# EasyEDA Pro project ProDoc_Board1_1_2025-02-10.epro

# Schematic Schematic1_1
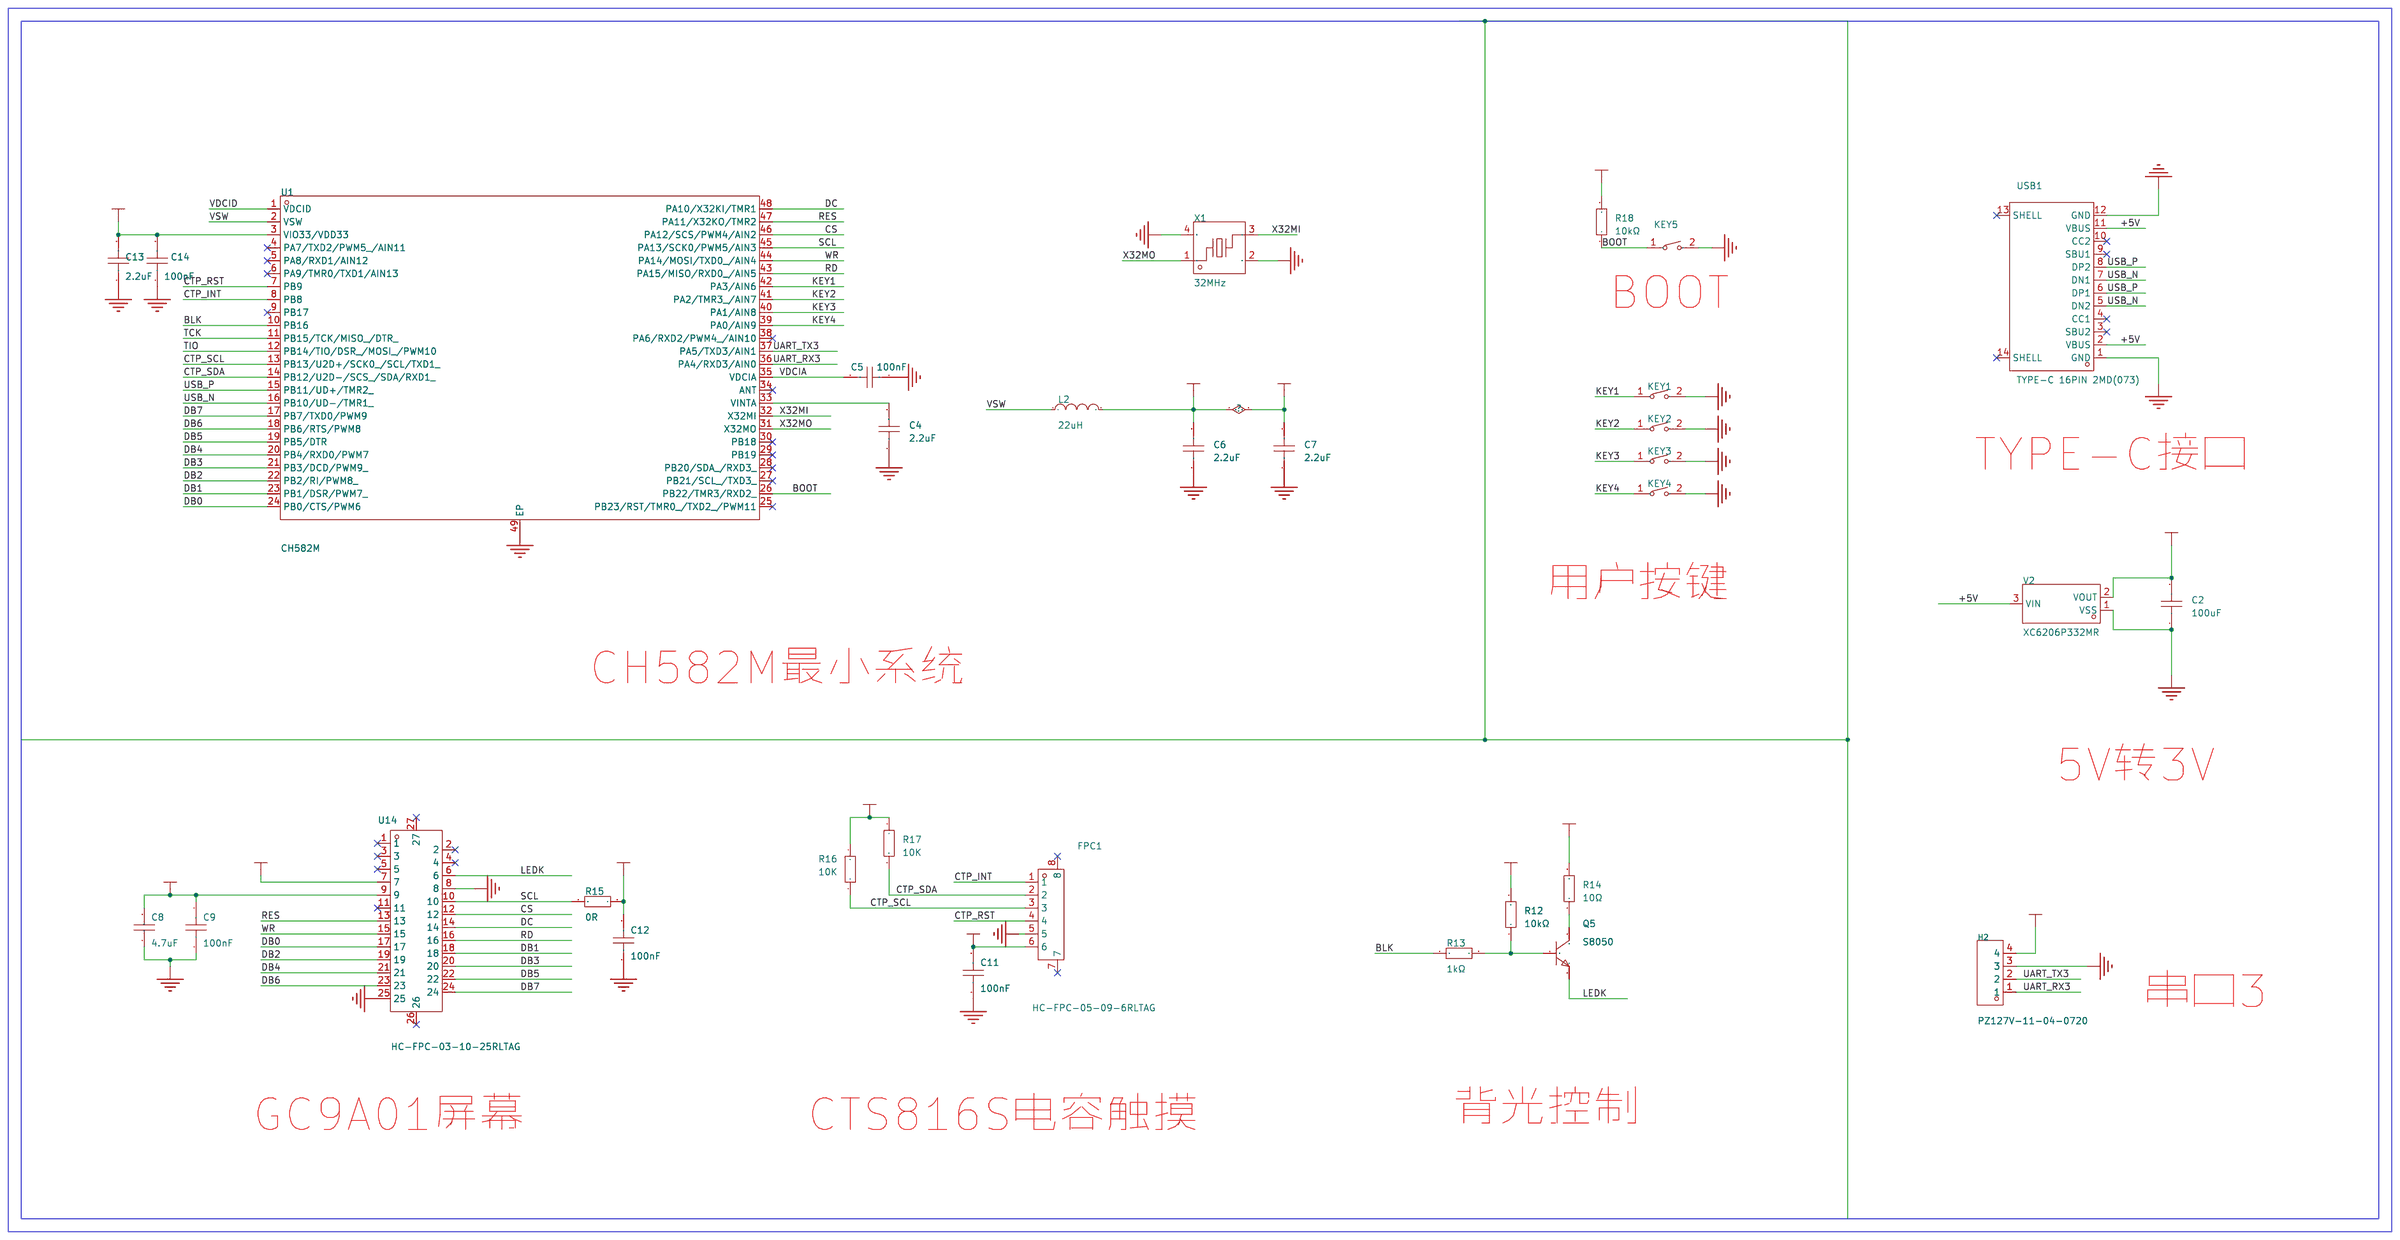
[diagram p0: schematic sheet]

## Parts
C2  100uF  [C1206]
C4  2.2uF  [C0603]
C5  100nF  [C0603]
C6  2.2uF  [C0603]
C7  2.2uF  [C0603]
C8  4.7uF  [C0603]
C9  100nF  [C0603]
C11  100nF  [C0603]
C12  100nF  [C0603]
C13  2.2uF  [C0603]
C14  100nF  [C0603]
FPC1  HC-FPC-05-09-6RLTAG  [FPC-SMD_6P-P0.50_HC-FPC-05-09-6RLTAG]
H2  PZ127V-11-04-0720  [HDR-TH_4P-P1.27-V-M]
KEY1  YTS1C0051AWG00  [SW-SMD_L6.1-W3.6-LS8.0]
KEY2  YTS1C0051AWG00  [SW-SMD_L6.1-W3.6-LS8.0]
KEY3  YTS1C0051AWG00  [SW-SMD_L6.1-W3.6-LS8.0]
KEY4  YTS1C0051AWG00  [SW-SMD_L6.1-W3.6-LS8.0]
KEY5  YTS1C0051AWG00  [SW-SMD_L6.1-W3.6-LS8.0]
L2  22uH  [L0603]
Q5  S8050  [SOT-23-3_L2.9-W1.3-P1.90-LS2.4-BR]
R12  10kΩ  [R0603]
R13  1kΩ  [R0603]
R14  10Ω  [R0603]
R15  0R  [R0603]
R16  10K  [R0603]
R17  10K  [R0603]
R18  10kΩ  [R0603]
U1  CH582M  [QFN-48_L5.0-W5.0-P0.35-BL-EP]
U14  HC-FPC-03-10-25RLTAG  [FPC-SMD_HCTL_HC-FPC-03-10-25RLTAG]
USB1  TYPE-C 16PIN 2MD(073)  [USB-C-SMD_TYPE-C-6PIN-2MD-073]
V2  XC6206P332MR  [SOT-23-3_L3.0-W1.7-P0.95-LS2.9-BR]
X1  32MHz  [CRYSTAL-SMD_4P-L2.0-W1.6-BL]

## Library data of the parts
C2 C4-C7 C13 = CAP_0603: Supplier Footprint: 0603
C8 = CL10A475KO8NNNC: 容值:4.7uF;精度:±10%;额定电压:16V;材质(温度系数):X5R;; LCSC Part Name: 4.7uF ±10% 16V; Supplier Part: C19666; Manufacturer: SAMSUNG(三星); Supplier Footprint: 0603; JLCPCB Part Class: 基础库; Datasheet: https://atta.szlcsc.com/upload/public/pdf/source/20160218/1457707763339.pdf; Supplier: LCSC; Tolerance: ±10%; Voltage Rated: 16V; Temperature Coefficient: X5R
C9 C11 C12 C14 = CC0603KRX7R9BB104: 容值:100nF;精度:±10%;额定电压:50V;材质(温度系数):X7R;; LCSC Part Name: 100nF ±10% 50V; Supplier Part: C14663; Manufacturer: YAGEO(国巨); Supplier Footprint: 0603; JLCPCB Part Class: 基础库; Datasheet: https://atta.szlcsc.com/upload/public/pdf/source/20180910/C282072_33301C7F631E79921B82A8DAC6BCC5B3.pdf; Supplier: LCSC; Tolerance: ±10%; Voltage Rated: 50V; Temperature Coefficient: X7R
FPC1 = HC-FPC-05-09-6RLTAG: 锁定特性:翻盖式;触点类型:双侧触点/上下接;触点数量:6P;间距:0.5mm;安装类型:卧贴;工作温度范围:-55℃~+85℃;; LCSC Part Name: 翻盖式 双侧触点/上下接 P数:6P 间距:0.5mm; Supplier Part: C5213748; Manufacturer: HCTL(华灿天禄); Supplier Footprint: SMD,P=0.5mm,卧贴; JLCPCB Part Class: 扩展库; Datasheet: https://atta.szlcsc.com/upload/public/pdf/source/20221026/52A26161A88FCE07A06989F8D4399614.pdf; Supplier: LCSC; Locking Feature: 翻盖式; Contact Type: 双侧触点/上下接; Number of Contacts: 6P; Pitch: 0.5mm; Mounting Type: 卧贴; FFC, FCB Thickness: 0.3mm; Height Above Board: 1mm; Contact Material: 铜合金; Operating Temperature Range: -55℃~+85℃
H2 = PZ127V-11-04-0720: 插针结构:1x4P;间距:1.27mm;行距:-;圆针/方针:-;安装类型:直插;排数:单排;总PIN位数:4P;额定电流:-;额定电压:-;配合针长度:3.9mm;塑高:1mm;端接针长度:2.3mm;触头材质:黄铜;触头镀层:-;工作温度范围:-40℃~+105℃;焊接温度(最大值):-;颜色:黑色;; LCSC Part Name: 间距:1.27mm 1x4P 直插; Supplier Part: C541879; Manufacturer: XFCN(兴飞); Supplier Footprint: 插件,P=1.27mm; JLCPCB Part Class: 扩展库; Datasheet: https://atta.szlcsc.com/upload/public/pdf/source/20200519/C541879_5CD99C402ABEE613587AE88FBA356357.pdf; Supplier: LCSC; Pin Structure: 1x4P; Pitch: 1.27mm; Mounting Type: 直插; Number of Rows: 单排; Number of Pins: 4P; Length of Mating Pin: 3.9mm; Insulation Height: 1mm; Length of End Connection Pin: 2.3mm; Contact Material: 黄铜; Operating Temperature Range: -40℃~+105℃; Color: 黑色
KEY1-KEY5 = YTS1C0051AWG00: 开关长度:6.1mm;开关宽度:3.6mm;开关高度:2.5mm;机械寿命:-;; LCSC Part Name: 白色按键头3.6x6.1x2.5 180gf两脚贴片; Supplier Part: C5159017; Manufacturer: YIYUAN(怡远); Supplier Footprint: SMD; JLCPCB Part Class: 扩展库; Datasheet: https://atta.szlcsc.com/upload/public/pdf/source/20220909/90D1F3506E0247DF6BB595157A95988A.pdf; Supplier: LCSC; Switch Length: 6.1mm; Switch Width: 3.6mm; Switch Height: 2.5mm
L2 = L_0603
Q5 = S8050: NPN 25V 500mA 120-400 SOT-23; Supplier Part: C2931719; Manufacturer: Doeshare(德芯); Supplier Footprint: SOT-23; JLCPCB Part Class: 扩展库; Datasheet: https://atta.szlcsc.com/upload/public/pdf/source/20220117/E6D3315E0D6ADDB25840BFFAC039C5C0.pdf; Supplier: LCSC
R12 R18 = 0603WAF1002T5E: 电阻类型:厚膜电阻;阻值:10kΩ;精度:±1%;功率:100mW;最大工作电压:75V;温度系数:±100ppm/℃;; LCSC Part Name: 厚膜电阻 10kΩ ±1% 100mW; Supplier Part: C25804; Manufacturer: UNI-ROYAL(厚声); Supplier Footprint: 0603; JLCPCB Part Class: 基础库; Datasheet: https://atta.szlcsc.com/upload/public/pdf/source/20200306/C422600_1E6D84923E4A46A82E41ADD87F860B5C.pdf; Supplier: LCSC; Type: 厚膜电阻; Tolerance: ±1%; Power(Watts): 100mW; Overload Voltage (Max): 75V; Temperature Coefficient: ±100ppm/℃; Operating Temperature Range: -55℃~+155℃
R13 = 0603WAF1001T5E: 电阻类型:厚膜电阻;阻值:1kΩ;精度:±1%;功率:100mW;最大工作电压:75V;温度系数:±100ppm/℃;; LCSC Part Name: 1kΩ ±1% 100mW 厚膜电阻; Supplier Part: C21190; Manufacturer: UNI-ROYAL(厚声); Supplier Footprint: 0603; JLCPCB Part Class: 基础库; Datasheet: https://atta.szlcsc.com/upload/public/pdf/source/20200306/C422600_1E6D84923E4A46A82E41ADD87F860B5C.pdf; Supplier: LCSC; Type: 厚膜电阻; Tolerance: ±1%; Power(Watts): 100mW; Overload Voltage (Max): 75V; Temperature Coefficient: ±100ppm/℃; Operating Temperature Range: -55℃~+155℃
R14 = 0603WAF100JT5E: 电阻类型:厚膜电阻;阻值:10Ω;精度:±1%;功率:100mW;最大工作电压:75V;温度系数:±400ppm/℃;; LCSC Part Name: 10Ω ±1% 100mW 厚膜电阻; Supplier Part: C22859; Manufacturer: UNI-ROYAL(厚声); Supplier Footprint: 0603; JLCPCB Part Class: 基础库; Datasheet: https://atta.szlcsc.com/upload/public/pdf/source/20200306/C422600_1E6D84923E4A46A82E41ADD87F860B5C.pdf; Supplier: LCSC; Type: 厚膜电阻; Tolerance: ±1%; Power(Watts): 100mW; Overload Voltage (Max): 75V; Temperature Coefficient: ±400ppm/℃; Operating Temperature Range: -55℃~+155℃
R15-R17 = Res_0603: Supplier Footprint: 0603
U1 = CH582M: CPU内核:RISC-V;程序存储容量:512KB;RAM总容量:32KB;GPIO端口数量:40;工作电压范围:2.3V~3.6V;CPU最大主频:80MHz;程序存储器类型:FLASH;; Supplier Part: C2920766; Manufacturer: WCH(南京沁恒); Supplier Footprint: QFN-48-EP(5x5); JLCPCB Part Class: 扩展库; Datasheet: https://atta.szlcsc.com/upload/public/pdf/source/20220111/7785F6388C97C318998CCEA67CDD9164.pdf; Supplier: LCSC; CPU Core: RISC-V; Program Storage Size: 512KB; RAM Size: 32KB; GPIO Ports Number: 40; Operating Voltage Range: 2.3V~3.6V; CPU Maximum Speed: 80MHz; Program Memory Type: FLASH; Operating Temperature Range: -40℃~+85℃; ADC (Bit): 12bit; PWM (Bit): 26bit; 32Bit Timer: 4; UART/USART: 4; I2C: 1; SPI: 2
U14 = HC-FPC-03-10-25RLTAG_C3012332: 锁定特性:翻盖式;触点类型:下接;触点数量:25P;间距:0.3mm;安装类型:卧贴;工作温度范围:-55℃~+85℃;; LCSC Part Name: 翻盖式 下接 P数:25P 间距:0.3mm; Supplier Part: C3012332; Manufacturer: HCTL(华灿天禄); Supplier Footprint: SMD,P=0.3mm,卧贴; JLCPCB Part Class: 扩展库; Datasheet: https://atta.szlcsc.com/upload/public/pdf/source/20240313/E73B8B009859F95ACD7D175A0E675B64.pdf; Supplier: LCSC; Locking Feature: 翻盖式; Contact Type: 下接; Number of Contacts: 25P; Pitch: 0.3mm; Mounting Type: 卧贴; FFC, FCB Thickness: 0.2mm; Height Above Board: 1mm; Contact Material: 铜合金; Contact Plating: 金; Operating Temperature Range: -55℃~+85℃
USB1 = TYPE-C 16PIN 2MD(073): 连接器类型:Type-C;标准:USB 3.1;公母:母;安装方式:卧贴;触点数量:16P;端口数量:1;额定电流 - 电源:5A;工作温度范围:-25℃~+85℃;; LCSC Part Name: Type-C 母 卧贴; Supplier Part: C2765186; Manufacturer: SHOU HAN(首韩); Supplier Footprint: SMD; Datasheet: https://atta.szlcsc.com/upload/public/pdf/source/20211123/39B17C16241EAC15C5E277BDA434118E.pdf; Supplier: LCSC; Connector Type: Type-C; Standard: USB 3.1; Gender: 母; Mounting Style: 卧贴; Number of Contacts: 16P; Number of Ports: 1; Current Rating - Power (Max): 5A; Operating Temperature Range: -25℃~+85℃; Rated Voltage (Max): 5V; Connect-Disconnect Life: 5千次; Core Colour: 黑色
V2 = XC6206P332MR_C347376: +3V3; LCSC Part Name: +3V3; Supplier Part: C347376; Manufacturer: UMW(友台半导体); Supplier Footprint: SOT-23; JLCPCB Part Class: 扩展库; Datasheet: https://atta.szlcsc.com/upload/public/pdf/source/20231109/6B10DA60E52FC900BF97E3EFEB5D6341.pdf; Supplier: LCSC; Output Type: 固定; Maximum Input Voltage: 8V; Output Voltage: +3V3; MAX Output Current: 250mA; Power Supply Rejection Ratio (PSRR): 40dB@(1kHz); Dropout Voltage: 240mV@(50mA); Operating Temperature: -25℃~+80℃; Output Polarity: 正极; Number of Outputs: 1
X1 = XL7EL89CKI-111YLC-32M: 晶振类型:贴片晶振;频率:32MHz;常温频差:±10ppm;外接负载电容:8pF;频率稳定度(全温):±20ppm;; LCSC Part Name: 32MHz ±10ppm 8pF; Supplier Part: C2965582; Manufacturer: YXC(扬兴晶振); Supplier Footprint: SMD2016-4P; JLCPCB Part Class: 扩展库; Datasheet: https://atta.szlcsc.com/upload/public/pdf/source/20240329/C26C9A15A73CBCFBF373B30A8E126750.pdf; Supplier: LCSC; Crystal Type: 贴片晶振; Normal temperature Frequency Tolerance: ±10ppm; External load capacitor: 8pF; Frequency Stability(Full temperature range): ±20ppm; Operating Temperature: -40℃~+85℃

## Nets
+3V3: C2.2 C8.2 C9.2 C11.2 C12.2 C13.2 C14.2 FPC1.6 H2.4 R12.2 R14.2 R15.1 R16.1 R17.1 R18.2 U1.3(VIO33/VDD33) U14.7 U14.9 V2.2(VOUT)
+5V: USB1.2(VBUS) USB1.11(VBUS) V2.3(VIN)
GND: C2.1 C4.1 C5.1 C6.1 C7.1 C8.1 C9.1 C11.1 C12.1 C13.1 C14.1 FPC1.5 H2.3 KEY1.2 KEY2.2 KEY3.2 KEY4.2 KEY5.2 U1.49(EP) U14.8 U14.25 USB1.1(GND) USB1.12(GND) V2.1(VSS) X1.2(GND) X1.4(GND)
BLK: R13.1 U1.10(PB16)
BOOT: KEY5.1 R18.1 U1.26(PB22/TMR3/RXD2_)
CS: U1.46(PA12/SCS/PWM4/AIN2) U14.12
CTP_INT: FPC1.1 U1.8(PB8)
CTP_RST: FPC1.4 U1.7(PB9)
CTP_SCL: FPC1.3 R16.2 U1.13(PB13/U2D+/SCK0_/SCL/TXD1_)
CTP_SDA: FPC1.2 R17.2 U1.14(PB12/U2D-/SCS_/SDA/RXD1_)
DB0: U1.24(PB0/CTS/PWM6) U14.17
DB1: U1.23(PB1/DSR/PWM7_) U14.18
DB2: U1.22(PB2/RI/PWM8_) U14.19
DB3: U1.21(PB3/DCD/PWM9_) U14.20
DB4: U1.20(PB4/RXD0/PWM7) U14.21
DB5: U1.19(PB5/DTR) U14.22
DB6: U1.18(PB6/RTS/PWM8) U14.23
DB7: U1.17(PB7/TXD0/PWM9) U14.24
DC: U1.48(PA10/X32KI/TMR1) U14.14
KEY1: KEY1.1 U1.42(PA3/AIN6)
KEY2: KEY2.1 U1.41(PA2/TMR3_/AIN7)
KEY3: KEY3.1 U1.40(PA1/AIN8)
KEY4: KEY4.1 U1.39(PA0/AIN9)
LEDK: Q5.2(E) U14.6
RD: U1.43(PA15/MISO/RXD0_/AIN5) U14.16
RES: U1.47(PA11/X32KO/TMR2) U14.13
SCL: R15.2 U1.45(PA13/SCK0/PWM5/AIN3) U14.10
TCK: U1.11(PB15/TCK/MISO_/DTR_)
TIO: U1.12(PB14/TIO/DSR_/MOSI_/PWM10)
UART_RX3: H2.1 U1.36(PA4/RXD3/AIN0)
UART_TX3: H2.2 U1.37(PA5/TXD3/AIN1)
USB_N: U1.16(PB10/UD-/TMR1_) USB1.5(DN2) USB1.7(DN1)
USB_P: U1.15(PB11/UD+/TMR2_) USB1.6(DP1) USB1.8(DP2)
VDCIA: C5.2 C6.2 C7.2 L2.2 U1.1(VDCID) U1.35(VDCIA)
VSW: L2.1 U1.2(VSW)
WR: U1.44(PA14/MOSI/TXD0_/AIN4) U14.15
X32MI: U1.32(X32MI) X1.3
X32MO: U1.31(X32MO) X1.1
Net-(C4-2): C4.2 U1.33(VINTA)
Net-(Q5-1): Q5.1(B) R12.1 R13.2
Net-(Q5-3): Q5.3(C) R14.1

Not connected (* = marked no-connect by the designer): FPC1 7* 8*; U1 4(PA7/TXD2/PWM5_/AIN11)* 5(PA8/RXD1/AIN12)* 6(PA9/TMR0/TXD1/AIN13)* 9(PB17)* 25(PB23/RST/TMR0_/TXD2_/PWM11)* 27(PB21/SCL_/TXD3_)* 28(PB20/SDA_/RXD3_)* 29(PB19)* 30(PB18)* 34(ANT)* 38(PA6/RXD2/PWM4_/AIN10)*; U14 1* 2* 3* 4* 5* 11* 26* 27*; USB1 3(SBU2)* 4(CC1)* 9(SBU1)* 10(CC2)* 13(SHELL)* 14(SHELL)*

## Notes on the sheet
- BOOT
- TYPE-C接口
- 用户按键
- CH582M最小系统
- 5V转3V
- 串口3
- 背光控制
- GC9A01屏幕
- CTS816S电容触摸

# Board PCB1_1
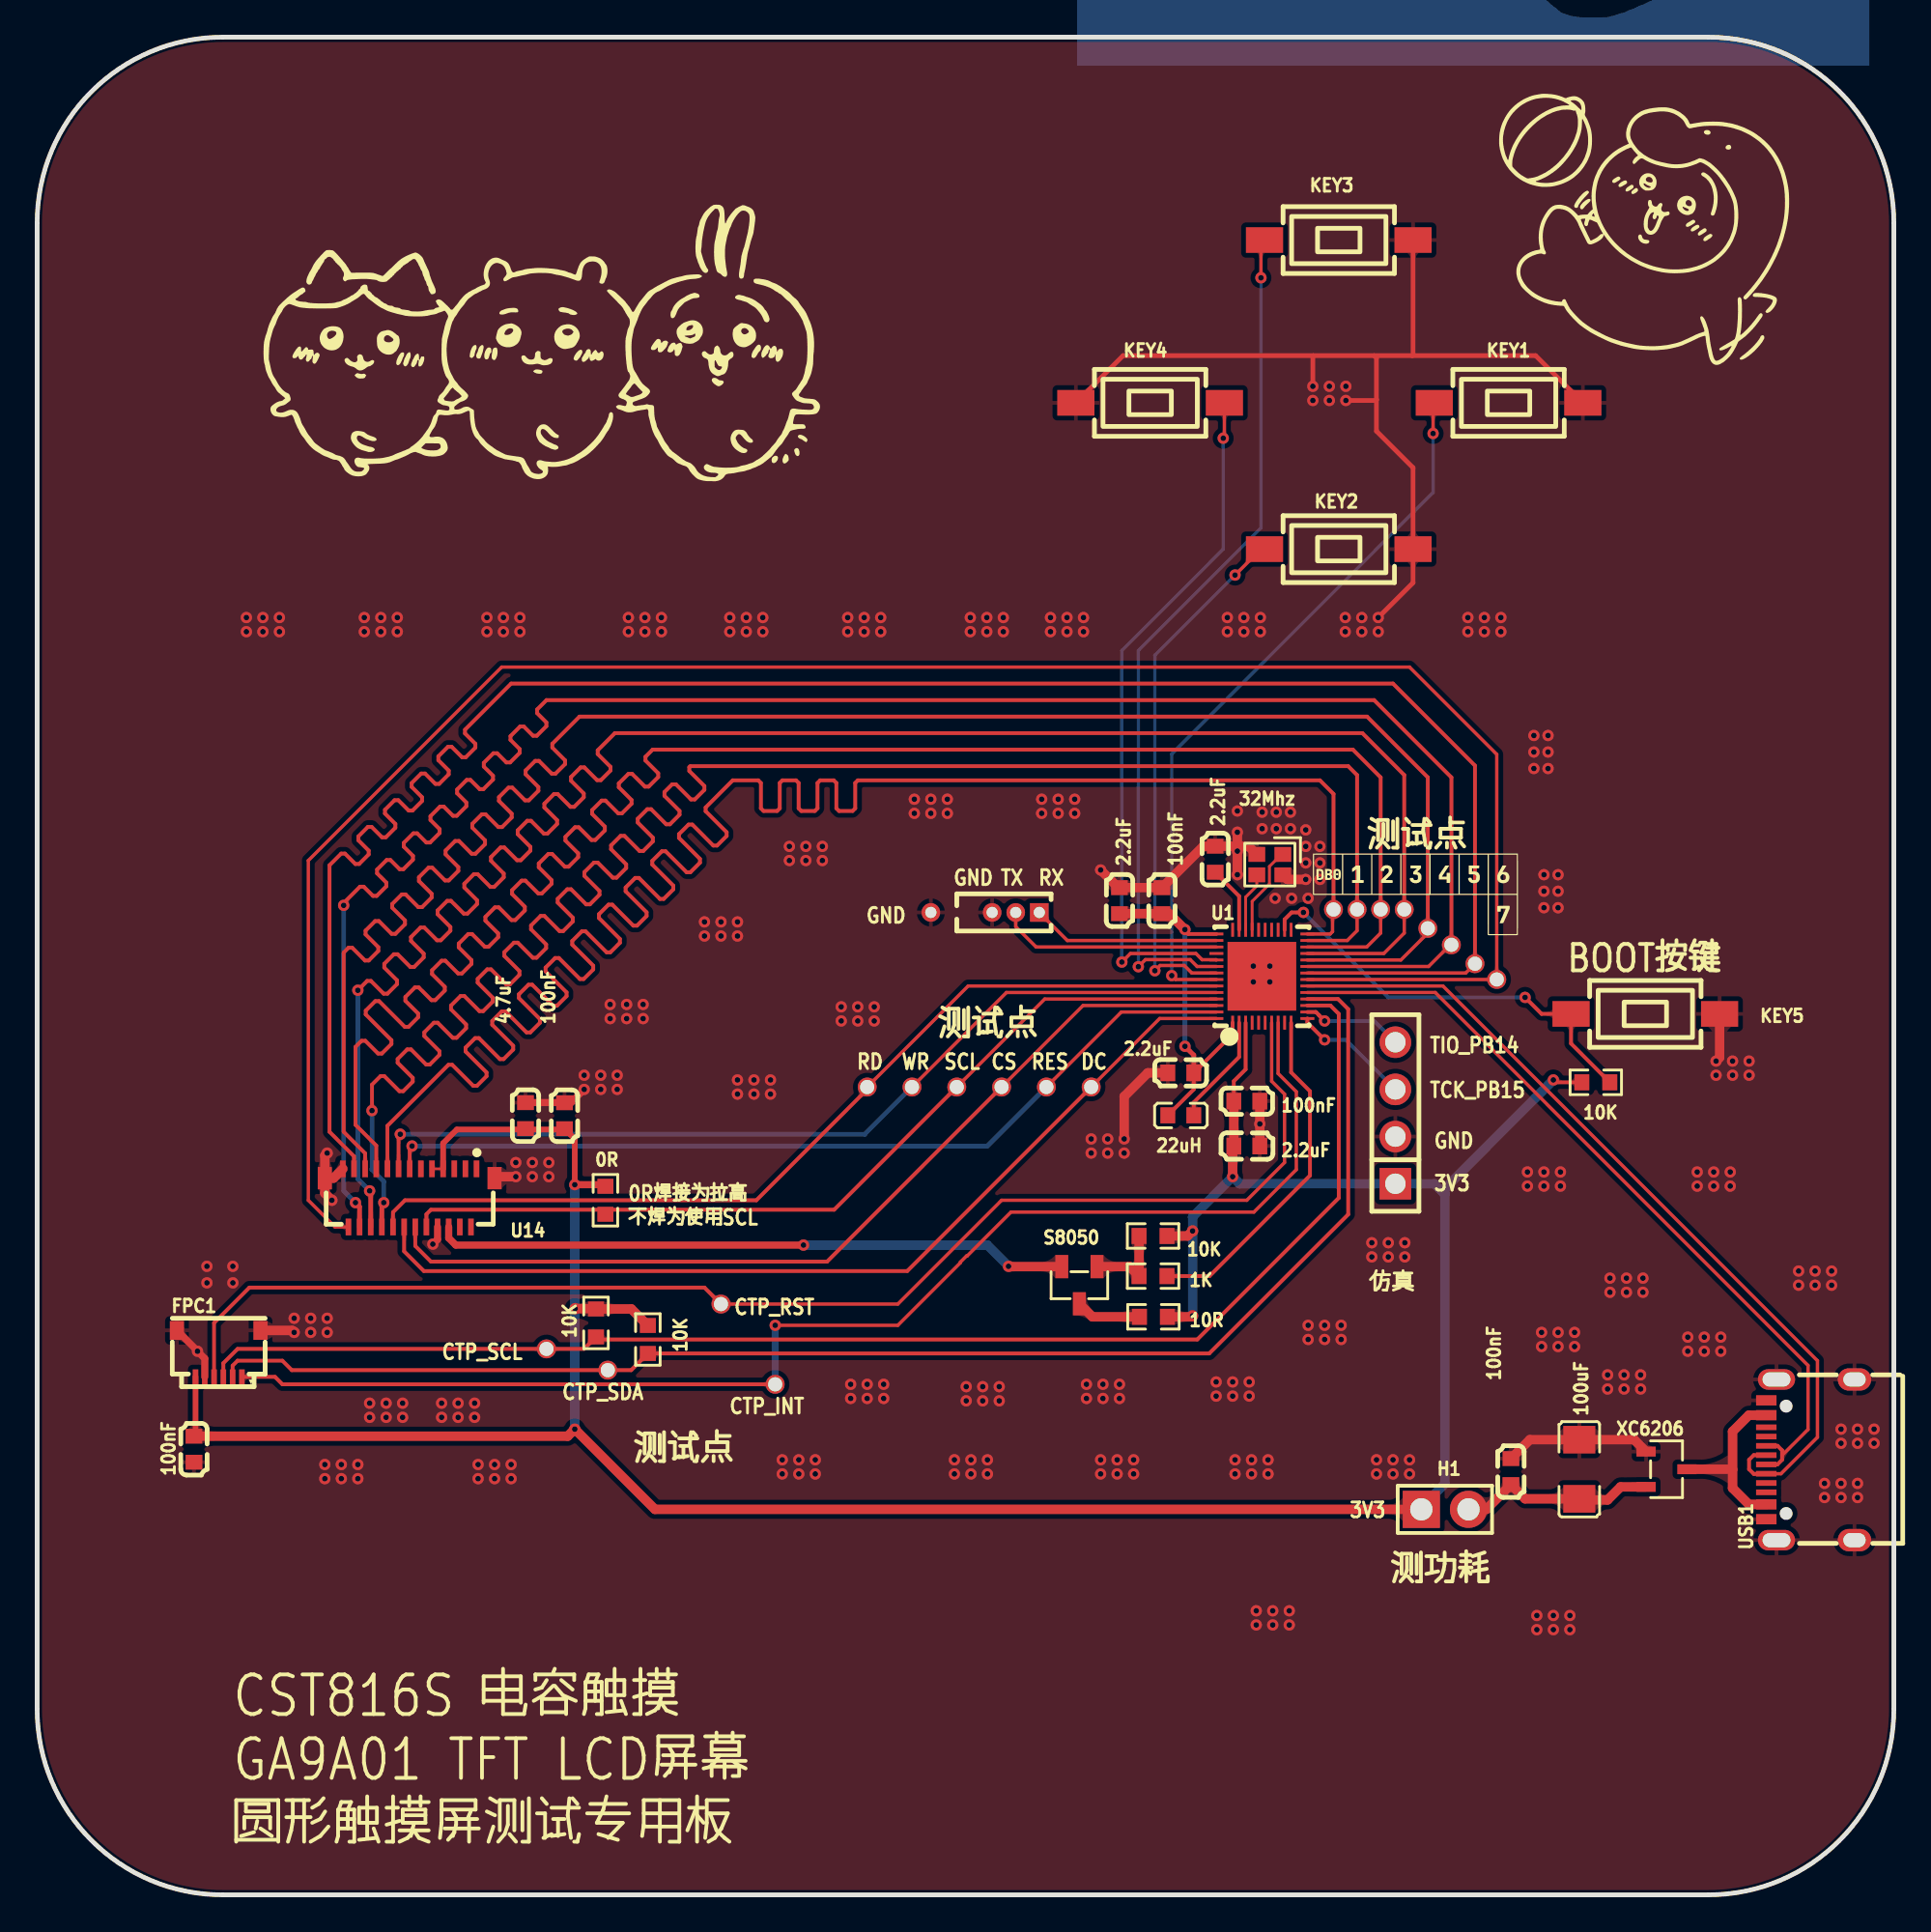
[diagram p1: board, top side]
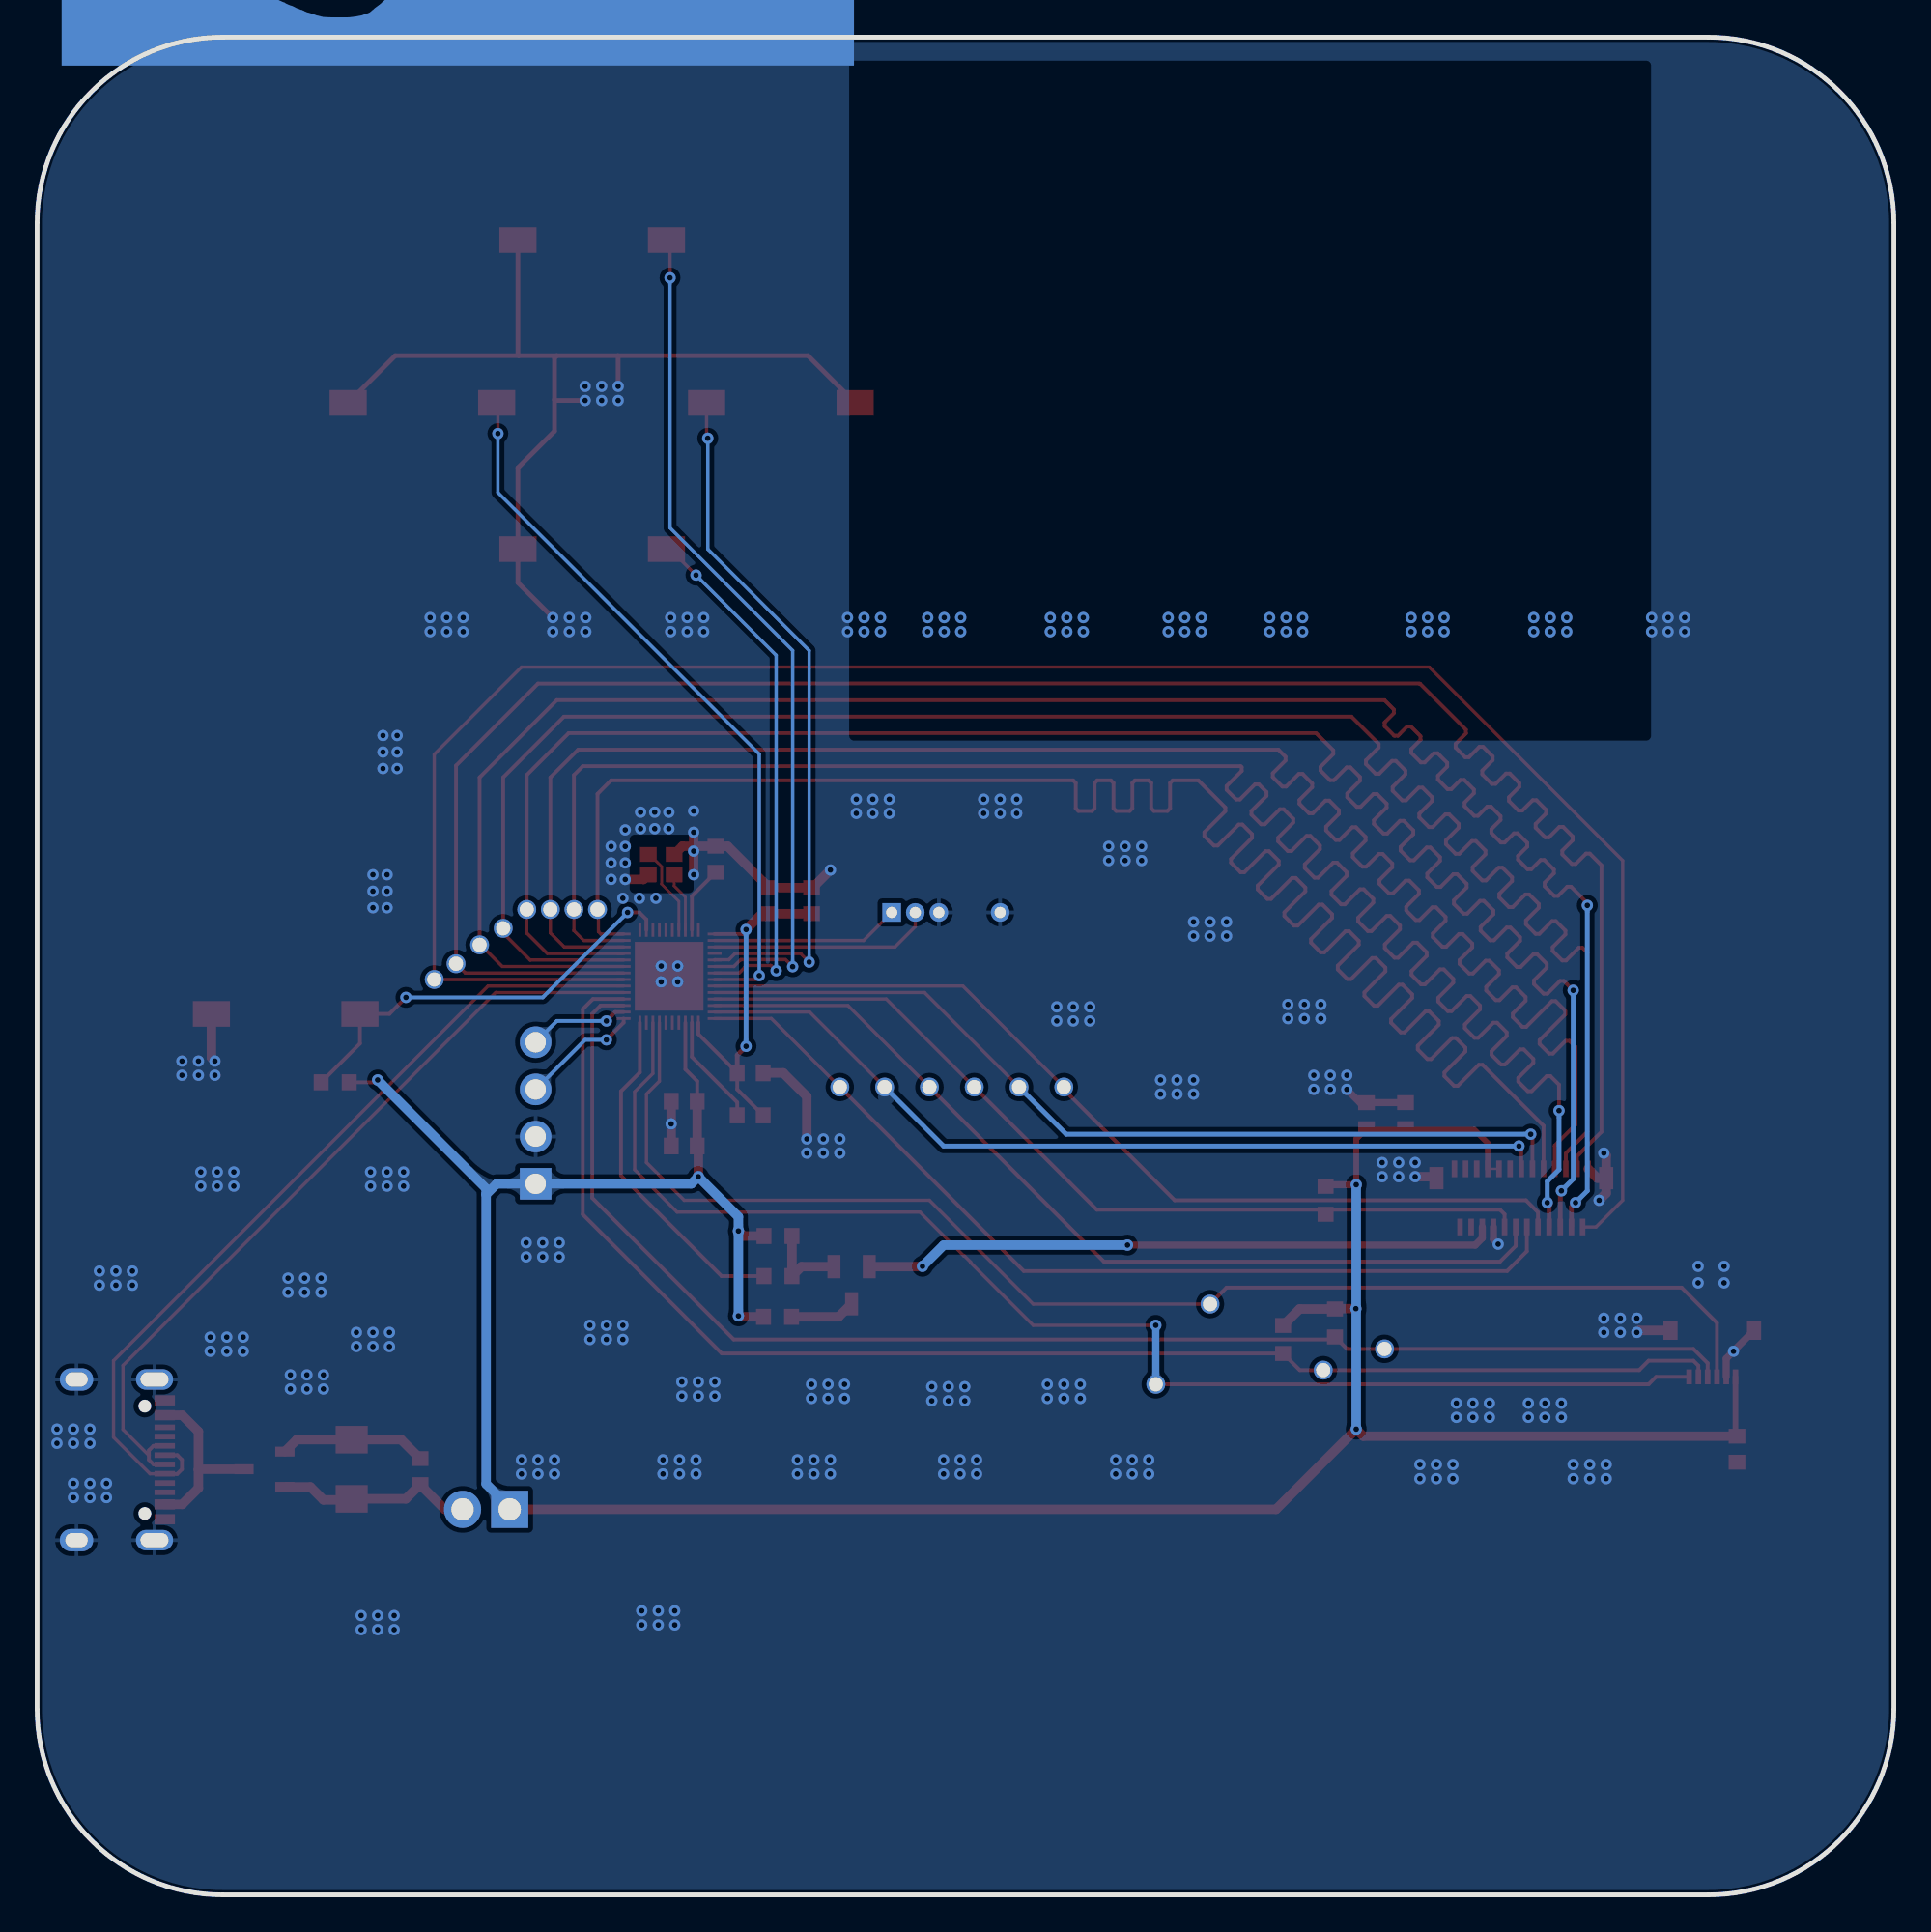
[diagram p2: board, bottom side, seen from below]

Outline 100 x 100 mm; copper layers: Top Layer, Bottom Layer. Coordinates in mm from the lower left corner of the outline.
Outline path: 0,90 0,10 arc(2.93,2.93) 10,0 90,0 arc(97.07,2.93) 100,10 100,90 arc(97.07,97.07) 90,100 10,100 arc(2.93,97.07) 0,90
Stack: Top Layer 0.035mm / Dielectric1 1.51mm FR4 er 4.5 / Bottom Layer 0.035mm

## Design rules (mm)
template: 自定义配置
spacing copperThickness1oz (default): track to track 0.102, other pairs 0.152 to 0.3
spacing copperThickness2oz: track to track 0.203, other pairs 0.152 to 0.3
track width copperThickness1oz (default): min 0.127, default 0.254, max 2.54
track width copperThickness2oz: min 0.203, default 0.254, max 2.54
differential pair differentialPair (default): width min 0.127, default 0.254, max 2.54; gap min 0.152, default 0.152
via viaSize (default): diameter min 0.5, default 0.61, max 10; hole min 0.3, default 0.305, max 6.3

## Placement (name value [footprint] x y rotation side)
0R  0R  [R0603]  30.61 37.39 270 top
1K  1kΩ  [R0603]  60.1 33.31 180 top
2.2uF  -  [C0603]  63.45 55.75 270 top
2.2uF#2  -  [C0603]  58.29 53.52 270 top
2.2uF#3  -  [C0603]  61.59 44.25 0 top
2.2uF#4  -  [C0603]  65.15 40.31 180 top
4.7uF  4.7uF  [C0603]  26.3 41.95 270 top
10K  -  [R0603]  60.1 35.47 0 top
10K#2  -  [R0603]  30.1 30.79 270 top
10K#3  -  [R0603]  32.89 29.9 270 top
10K#4  -  [R0603]  83.95 43.74 180 top
10R  10Ω  [R0603]  60.12 31.12 0 top
22uH  22uH  [L0603]  61.59 41.96 180 top
32Mhz  32MHz  [CRYSTAL-SMD_4P-L2.0-W1.6-BL]  66.39 55.46 180 top
100nF  -  [C0603]  28.4 41.94 270 top
100nF#2  -  [C0603]  8.45 23.99 90 top
100nF#3  -  [C0603]  79.37 22.78 270 top
100nF#4  -  [C0603]  65.15 42.72 180 top
100nF#5  -  [C0603]  60.58 53.52 270 top
100uF  100uF  [C1206]  83.06 22.91 270 top
FPC1  HC-FPC-05-09-6RLTAG  [FPC-SMD_6P-P0.50_HC-FPC-05-09-6RLTAG]  9.78 29.13 0 top
H1  PZ254V-11-02P  [HDR-TH_2P-P2.54-V-M]  75.82 20.75 0 top
KEY1  YTS1C0051AWG00  [SW-SMD_L6.1-W3.6-LS8.0]  79.25 80.32 0 top
KEY2  YTS1C0051AWG00  [SW-SMD_L6.1-W3.6-LS8.0]  70.1 72.44 0 top
KEY3  YTS1C0051AWG00  [SW-SMD_L6.1-W3.6-LS8.0]  70.1 89.08 0 top
KEY4  YTS1C0051AWG00  [SW-SMD_L6.1-W3.6-LS8.0]  59.94 80.32 180 top
KEY5  YTS1C0051AWG00  [SW-SMD_L6.1-W3.6-LS8.0]  86.61 47.42 0 top
NOREF  -  [Pad_e1168]  36.83 31.8 0 top
NOREF#2  -  [Pad_e122]  72.36 53.04 0 top
NOREF#3  -  [Pad_e1167]  39.75 27.48 0 top
NOREF#4  -  [Pad_e134]  76.17 51.14 0 top
NOREF#5  -  [Pad_e109]  69.82 53.04 0 top
NOREF#6  -  [Pad_e1414]  51.94 43.48 0 top
NOREF#7  -  [Pad_e135]  77.44 50.12 0 top
NOREF#8  -  [Pad_e1418]  47.12 43.48 0 top
NOREF#9  -  [Pad_e1169]  27.43 29.39 0 top
NOREF#10  -  [Pad_e129]  73.63 53.04 0 top
NOREF#11  -  [Pad_e1413]  56.77 43.48 0 top
NOREF#12  -  [Pad_e110]  71.09 53.04 0 top
NOREF#13  -  [Pad_e133]  74.9 52.03 0 top
NOREF#14  -  [Pad_e1419]  44.7 43.48 0 top
NOREF#15  -  [Pad_e1417]  49.53 43.48 0 top
NOREF#16  -  [Pad_e154]  78.61 49.28 0 top
NOREF#17  -  [Pad_e1416]  54.36 43.48 0 top
NOREF#18  -  [Pad_e1170]  30.73 28.25 0 top
RX  PZ127V-11-04-0720  [HDR-TH_4P-P1.27-V-M]  52.07 52.88 180 top
S8050  S8050  [SOT-23-3_L2.9-W1.3-P1.90-LS2.4-BR]  56.13 32.82 90 top
U1  CH582M  [QFN-48_L5.0-W5.0-P0.35-BL-EP]  65.96 49.45 0 top
U14  HC-FPC-03-10-25RLTAG  [FPC-SMD_HCTL_HC-FPC-03-10-25RLTAG]  20.07 37.52 180 top
USB1  TYPE-C 16PIN 2MD(073)  [USB-C-SMD_TYPE-C-6PIN-2MD-073]  95.5 23.42 90 top
XC6206  XC6206P332MR  [SOT-23-3_L3.0-W1.7-P0.95-LS2.9-BR]  87.76 22.91 180 top
仿真  2.54-1*4P母  [HDR-TH_4P-P2.54-V-F]  73.15 42.09 90 top

## Footprints (pads in the part's own frame, mm; a bottom-side part is the same pattern mirrored in y, then rotated)
C0603
  rect 0.8x0.9 smd: 1(-0.7,0) 2(0.7,0)
C1206
  rect 1.485x1.728 smd: 1(-1.593,0) 2(1.593,0)
CRYSTAL-SMD_4P-L2.0-W1.6-BL
  rect 0.9x0.8 smd: 1(-0.7,-0.55) 2(0.7,-0.55) 3(0.7,0.55) 4(-0.7,0.55)
FPC-SMD_6P-P0.50_HC-FPC-05-09-6RLTAG
  rect 0.3x0.8 smd: 1(1.25,-1.25) 2(0.75,-1.25) 3(0.25,-1.25) 4(-0.25,-1.25) 5(-0.75,-1.25) 6(-1.25,-1.25)
  rect 0.762x1.016 smd: 7(-2.25,1.25) 8(2.25,1.25)
FPC-SMD_HCTL_HC-FPC-03-10-25RLTAG
  rect 0.3x0.9 smd: 1(-3.6,-1.565) 2(-3.3,1.565) 3(-2.999,-1.565) 4(-2.7,1.565) 5(-2.4,-1.565) 6(-2.1,1.565) 7(-1.8,-1.565) 8(-1.5,1.565) 9(-1.2,-1.565) 10(-0.9,1.565) 11(-0.6,-1.565) 12(-0.299,1.565) 13(0.001,-1.565) 14(0.3,1.565) 15(0.6,-1.565) 16(0.9,1.565) 17(1.2,-1.565) 18(1.5,1.565) 19(1.8,-1.565) 20(2.1,1.565) 21(2.4,-1.565) 22(2.7,1.565) 23(3,-1.565) 24(3.3,1.565) 25(3.6,-1.565)
  rect 0.762x1.2 smd: 26(4.572,-1.065) 27(-4.572,-1.065)
HDR-TH_2P-P2.54-V-M
  rect 2x2 hole 1.2: 1(-1.27,0)
  round 2 hole 1.2: 2(1.27,0)
HDR-TH_4P-P1.27-V-M
  rect 1x1 hole 0.6: 1(-1.905,0)
  round 1 hole 0.6: 2(-0.635,0) 3(0.635,0) 4(3.937,0)
HDR-TH_4P-P2.54-V-F
  rect 1.7x1.7 hole 1.1: 1(-3.81,0)
  round 1.7 hole 1.1: 2(-1.27,0) 3(1.27,0) 4(3.81,0)
L0603
  rect 0.8x0.864 smd: 1(-0.7,0) 2(0.7,0)
Pad_e109
  round 1.016 hole 0.762: 1(0,0)
Pad_e110
  round 1.016 hole 0.762: 1(0,0)
Pad_e122
  round 1.016 hole 0.762: 1(0,0)
Pad_e129
  round 1.016 hole 0.762: 1(0,0)
Pad_e133
  round 1.016 hole 0.762: 1(0,0)
Pad_e134
  round 1.016 hole 0.762: 1(0,0)
Pad_e135
  round 1.016 hole 0.762: 1(0,0)
Pad_e154
  round 1.016 hole 0.762: 1(0,0)
Pad_e1167
  round 1.016 hole 0.762: 1(0,0)
Pad_e1168
  round 1.016 hole 0.762: 1(0,0)
Pad_e1169
  round 1.016 hole 0.762: 1(0,0)
Pad_e1170
  round 1.016 hole 0.762: 1(0,0)
Pad_e1413
  round 1.016 hole 0.762: 1(0,0)
Pad_e1414
  round 1.016 hole 0.762: 1(0,0)
Pad_e1416
  round 1.016 hole 0.762: 1(0,0)
Pad_e1417
  round 1.016 hole 0.762: 1(0,0)
Pad_e1418
  round 1.016 hole 0.762: 1(0,0)
Pad_e1419
  round 1.016 hole 0.762: 1(0,0)
QFN-48_L5.0-W5.0-P0.35-BL-EP
  rect 0.15x0.75 smd: 1(-1.575,-2.5) 2(-1.225,-2.5) 3(-0.875,-2.5) 4(-0.525,-2.5) 5(-0.175,-2.5) 6(0.175,-2.5) 7(0.525,-2.5) 8(0.875,-2.5) 9(1.225,-2.5) 10(1.575,-2.5) 25(1.575,2.5) 26(1.225,2.5) 27(0.875,2.5) 28(0.525,2.5) 29(0.175,2.5) 30(-0.175,2.5) 31(-0.525,2.5) 32(-0.875,2.5) 33(-1.225,2.5) 34(-1.575,2.5)
  rect 0.75x0.15 smd: 11(2.45,-2.275) 12(2.45,-1.925) 13(2.45,-1.575) 14(2.45,-1.225) 15(2.45,-0.875) 16(2.45,-0.525) 17(2.45,-0.175) 18(2.45,0.174) 19(2.45,0.525) 20(2.45,0.875) 21(2.45,1.225) 22(2.45,1.575) 23(2.45,1.925) 24(2.45,2.275) 35(-2.45,2.275) 36(-2.45,1.925) 37(-2.45,1.575) 38(-2.45,1.225) 39(-2.45,0.875) 40(-2.45,0.525) 41(-2.45,0.175) 42(-2.45,-0.175) 43(-2.45,-0.525) 44(-2.45,-0.875) 45(-2.45,-1.225) 46(-2.45,-1.575) 47(-2.45,-1.925) 48(-2.45,-2.275)
  rect 3.7x3.7 smd: 49(0,0)
R0603
  rect 0.806x0.864 smd: 1(-0.753,0) 2(0.753,0)
SOT-23-3_L2.9-W1.3-P1.90-LS2.4-BR
  rect 1.25x0.7 smd: 1(1,-0.95) 2(1,0.95) 3(-1,0)
SOT-23-3_L3.0-W1.7-P0.95-LS2.9-BR
  rect 1.038x0.532 smd: 1(1.101,-0.95) 2(1.101,0.95) 3(-1.101,0)
SW-SMD_L6.1-W3.6-LS8.0
  rect 2x1.38 smd: 1(-4,0) 2(4,0)
USB-C-SMD_TYPE-C-6PIN-2MD-073
  rect 0.55x1.1 smd: 1(-3.2,2.375) 2(-2.4,2.375) 11(2.4,2.375) 12(3.2,2.375)
  rect 0.3x1.1 smd: 3(-1.75,2.375) 4(-1.25,2.375) 5(-0.75,2.375) 6(-0.25,2.375) 7(0.25,2.375) 8(0.75,2.375) 9(1.25,2.375) 10(1.75,2.375)
  oval 1.1x2 hole 0.762x1.5: 13(-4.325,1.825) 14(4.325,1.825)
  oval 1.2x1.8 hole 0.762x1.2: 13(-4.325,-2.375) 14(4.325,-2.375)

## Nets
+3V3: 0R.1 2.2uF#4.2 4.7uF.2 10K.2 10K#2.1 10K#3.1 10K#4.2 10R.2 100nF.2 100nF#2.2 100nF#3.2 100nF#4.2 100uF.2 FPC1.6 H1.1 H1.2 U1.3 U14.7 U14.9 XC6206.2 仿真.1
+5V: USB1.2 USB1.11 XC6206.3
GND: 2.2uF.1 2.2uF#2.1 2.2uF#3.1 2.2uF#4.1 4.7uF.1 32Mhz.2 32Mhz.4 100nF.1 100nF#2.1 100nF#3.1 100nF#4.1 100nF#5.1 100uF.1 FPC1.5 FPC1.7 FPC1.8 KEY1.2 KEY2.2 KEY3.2 KEY4.2 KEY5.2 RX.3 RX.4 U1.49 U14.8 U14.25 U14.26 U14.27 USB1.1 USB1.12 USB1.13 USB1.14 XC6206.1 仿真.2
BLK: 1K.1 U1.10
BOOT: 10K#4.1 KEY5.1 U1.26
CS: NOREF#6.1 U1.46 U14.12
CTP_INT: FPC1.1 NOREF#3.1 U1.8
CTP_RST: FPC1.4 NOREF.1 U1.7
CTP_SCL: 10K#2.2 FPC1.3 NOREF#9.1 U1.13
CTP_SDA: 10K#3.2 FPC1.2 NOREF#18.1 U1.14
DB0: NOREF#5.1 U1.24 U14.17
DB1: NOREF#12.1 U1.23 U14.18
DB2: NOREF#2.1 U1.22 U14.19
DB3: NOREF#10.1 U1.21 U14.20
DB4: NOREF#13.1 U1.20 U14.21
DB5: NOREF#4.1 U1.19 U14.22
DB6: NOREF#7.1 U1.18 U14.23
DB7: NOREF#16.1 U1.17 U14.24
DC: NOREF#11.1 U1.48 U14.14
KEY1: KEY1.1 U1.42
KEY2: KEY2.1 U1.41
KEY3: KEY3.1 U1.40
KEY4: KEY4.1 U1.39
LEDK: S8050.2 U14.6
RD: NOREF#14.1 U1.43 U14.16
RES: NOREF#17.1 U1.47 U14.13
SCL: 0R.2 NOREF#15.1 U1.45 U14.10
TCK: U1.11 仿真.3
TIO: U1.12 仿真.4
UART_RX3: RX.1 U1.36
UART_TX3: RX.2 U1.37
USB_N: U1.16 USB1.5 USB1.7
USB_P: U1.15 USB1.6 USB1.8
VDCIA: 2.2uF#2.2 2.2uF#3.2 22uH.2 100nF#5.2 U1.1 U1.35
VSW: 22uH.1 U1.2
WR: NOREF#8.1 U1.44 U14.15
X32MI: 32Mhz.3 U1.32
X32MO: 32Mhz.1 U1.31
$1N1243: 2.2uF.2 U1.33
$1N4528: 1K.2 10K.1 S8050.1
$1N4553: 10R.1 S8050.3

Pads without a net: U1 4 5 6 9 25 27 28 29 30 34 38; U14 1 2 3 4 5 11; USB1 3 4 9 10

## Via types
v1: diameter 0.61, hole 0.305, Top Layer to Bottom Layer, 378 vias

## Routing (per net, layer and track width the routed paths; a pad name or vN(x,y) marks a point on that pad's centre or on a via; arc(x,y) is an arc through that point)
+3V3: length 172.2
  Top Layer w0.127: U14.9 U14.7
  Top Layer w0.203: 100nF#4.2 64.45,43.8 65.09,44.44 U1.3 ; 10K#4.2 81.79,43.74 v1(81.66,43.87)
  Top Layer w0.305: v1(28.96,38.23) 28.96,40.69 100nF.2 28.36,41.2 22.61,41.2 21.87,40.46 U14.7 ; FPC1.6 8.53,24.73
  Top Layer w0.381: v1(28.96,38.23) 30.52,38.23 0R.1
  Top Layer w0.508: v1(64.39,38.66) 64.39,40.25 2.2uF#4.2 100nF#4.2 ; 10K.2 61.96,35.47 v1(62.23,35.74) ; v1(62.23,31.17) 62.18,31.12 10R.2 ; 10K#3.1 32,31.54 10K#2.1 30.08,31.55 v1(28.97,31.55) ; XC6206.2 85.28,21.96 84.58,21.26 83.12,21.26 100uF.2 80.14,21.32 100nF#3.2 78.04,20.75 77.16,20.75 ; 8.53,24.73 8.57,24.69 28.58,24.69 v1(28.96,25.07) 33.27,20.75 74.38,20.75
  Bottom Layer w0.508: 75.82,37.71 75.82,22.12 74.45,20.75 ; 75.82,37.71 75.25,38.28 仿真.1 64.77,38.28 v1(64.39,38.66) 62.23,36.5 v1(62.23,35.74) v1(62.23,31.17) ; 75.82,37.71 75.82,38.02 v1(81.66,43.87) ; v1(28.96,25.07) v1(28.96,38.23)
+5V: length 9.9
  Top Layer w0.508: USB1.2 92.19,21.02 91.31,21.9 91.31,22.89 ; 91.31,22.89 91.31,24.94 92.19,25.82 USB1.11 ; 91.31,22.89 91.3,22.91 XC6206.3
GND: length 101
  Top Layer w0.254: 72.01,82.86 72.14,82.73 72.14,80.49 ; 72.01,82.86 74.06,82.86 ; 72.01,82.86 68.72,82.86 ; v1(72.23,68.76) 74.1,70.63 KEY2.2 74.1,76.82 72.14,78.79 72.14,80.49 ; 74.06,82.86 80.71,82.86 KEY1.2 ; 74.06,82.86 74.1,82.9 KEY3.2 ; 72.14,80.49 72.09,80.44 v1(70.48,80.44) ; 68.72,82.86 68.71,82.84 v1(68.71,81.2) ; 68.72,82.86 58.48,82.86 KEY4.2
  Top Layer w0.381: FPC1.5 9.03,28.87 v1(8.64,29.26) 8.64,29.28 FPC1.7 ; U14.8 21.57,35.28 21.31,35.03 ; 4.7uF.1 28.4,42.65 100nF.1 28.75,42.64 v1(29.46,43.36)
  Top Layer w0.508: U14.26 15.97,38.58 U14.25 ; U14.26 15.49,39.8 v1(15.62,39.93) ; U14.26 15.49,37.77 v1(15.88,37.39) ; 64.64,56.45 v1(64.64,56.19) v1(64.64,54.92) ; 64.64,56.45 v1(64.64,57.2) ; 64.64,56.45 65.25,56.45 32Mhz.2 ; 64.64,56.45 2.2uF.1 62.81,56.45 100nF#5.1 2.2uF#2.1 58.23,54.22 v1(57.28,55.17) ; U14.27 24.72,38.66 v1(25.78,38.66) ; XC6206.1 86.01,24.5 100uF.1 80.39,24.5 100nF#3.1 ; v1(13.84,30.28) 13.74,30.38 FPC1.8 ; v1(68.33,54.66) 67.34,54.66 32Mhz.4 ; 100nF#4.1 v1(65.85,41.5) 2.2uF#4.1 ; KEY5.2 90.61,45.07 v1(90.42,44.88) ; 2.2uF#3.1 59.82,44.25 58.55,42.98 v1(58.55,40.69)
  vias: v1(9.14,33.83) v1(9.14,32.94) v1(10.54,33.83) v1(10.54,32.94) v1(11.27,68.76) v1(11.27,68) v1(12.16,68.76) v1(12.16,68) v1(13.05,68.76) v1(13.05,68) v1(13.84,31.04) v1(14.73,31.04) v1(14.73,30.28) v1(15.49,23.16) v1(15.49,22.4) v1(15.62,31.04) v1(15.62,30.28) v1(16.38,23.16) v1(16.38,22.4) v1(17.27,23.16) v1(17.27,22.4) v1(17.62,68.76) v1(17.62,68) v1(17.91,26.47) v1(17.91,25.71) v1(18.51,68.76) v1(18.51,68) v1(18.8,26.47) v1(18.8,25.71) v1(19.4,68.76) v1(19.4,68) v1(19.68,26.47) v1(19.68,25.71) v1(21.31,35.03) v1(21.78,26.47) v1(21.78,25.71) v1(22.67,26.47) v1(22.67,25.71) v1(23.56,26.47) v1(23.56,25.71) v1(23.75,23.16) v1(23.75,22.4) v1(24.22,68.76) v1(24.22,68) v1(24.64,23.16) v1(24.64,22.4) v1(25.11,68.76) v1(25.11,68) v1(25.53,23.16) v1(25.53,22.4) v1(25.78,39.42) v1(26,68.76) v1(26,68) v1(26.67,39.42) v1(26.67,38.66) v1(27.56,39.42) v1(27.56,38.66) v1(29.46,44.12) v1(30.35,44.12) v1(30.35,43.36) v1(30.86,47.93) v1(30.86,47.17) v1(31.24,44.12) v1(31.24,43.36) v1(31.75,47.93) v1(31.75,47.17) v1(31.84,68.76) v1(31.84,68) v1(32.64,47.93) v1(32.64,47.17) v1(32.73,68.76) v1(32.73,68) v1(33.62,68.76) v1(33.62,68) v1(35.94,52.38) v1(35.94,51.61) v1(36.83,52.38) v1(36.83,51.61) v1(37.3,68.76) v1(37.3,68) v1(37.72,52.38) v1(37.72,51.61) v1(37.72,43.87) v1(37.72,43.1) v1(38.19,68.76) v1(38.19,68) v1(38.61,43.87) v1(38.61,43.1) v1(39.08,68.76) v1(39.08,68) v1(39.5,43.87) v1(39.5,43.1) v1(40.13,23.42) v1(40.13,22.66) v1(40.51,56.44) v1(40.51,55.68) v1(41.02,23.42) v1(41.02,22.66) v1(41.4,56.44) v1(41.4,55.68) v1(41.91,23.42) v1(41.91,22.66) v1(42.29,56.44) v1(42.29,55.68) v1(43.31,47.8) v1(43.31,47.04) v1(43.65,68.76) v1(43.65,68) v1(43.81,27.48) v1(43.81,26.72) v1(44.2,47.8) v1(44.2,47.04) v1(44.54,68.76) v1(44.54,68) v1(44.7,27.48) v1(44.7,26.72) v1(45.08,47.8) v1(45.08,47.04) v1(45.43,68.76) v1(45.43,68) v1(45.59,27.48) v1(45.59,26.72) v1(47.24,58.98) v1(47.24,58.22) v1(48.13,58.98) v1(48.13,58.22) v1(49.02,58.98) v1(49.02,58.22) v1(49.4,23.42) v1(49.4,22.66) v1(50.04,27.36) v1(50.04,26.59) v1(50.26,68.76) v1(50.26,68) v1(50.29,23.42) v1(50.29,22.66) v1(50.93,27.36) v1(50.93,26.59) v1(51.15,68.76) v1(51.15,68) v1(51.18,23.42) v1(51.18,22.66) v1(51.82,27.36) v1(51.82,26.59) v1(52.04,68.76) v1(52.04,68) v1(54.1,58.98) v1(54.1,58.22) v1(54.58,68.76) v1(54.58,68) v1(54.99,58.98) v1(54.99,58.22) v1(55.47,68.76) v1(55.47,68) v1(55.88,58.98) v1(55.88,58.22) v1(56.36,68.76) v1(56.36,68) v1(56.52,27.48) v1(56.52,26.72) v1(56.77,40.69) v1(56.77,39.93) v1(57.28,23.42) v1(57.28,22.66) v1(57.4,27.48) v1(57.4,26.72) v1(57.66,40.69) v1(57.66,39.93) v1(58.17,23.42) v1(58.17,22.66) v1(58.29,27.48) v1(58.29,26.72) v1(58.55,39.93) v1(59.05,23.42) v1(59.05,22.66) v1(63.5,27.61) v1(63.5,26.85) v1(64.1,68.76) v1(64.1,68) v1(64.39,27.61) v1(64.39,26.85) v1(64.52,23.42) v1(64.52,22.66) v1(64.64,58.34) v1(64.99,68.76) v1(64.99,68) v1(65.28,27.61) v1(65.28,26.85) v1(65.4,23.42) v1(65.4,22.66) v1(65.5,50) v1(65.5,49.14) v1(65.66,15.29) v1(65.66,14.53) v1(65.88,68.76) v1(65.88,68) v1(65.98,58.28) v1(65.98,57.39) v1(66.29,23.42) v1(66.29,22.66) v1(66.39,50) v1(66.39,49.14) v1(66.55,15.29) v1(66.55,14.53) v1(66.67,53.65) v1(66.74,58.28) v1(66.74,57.39) v1(67.5,58.28) v1(67.5,57.39) v1(67.44,15.29) v1(67.44,14.53) v1(67.56,53.65) v1(68.33,57.33) v1(68.33,56.44) v1(68.33,55.55) v1(68.45,53.65) v1(68.45,30.66) v1(68.45,29.9) v1(68.71,80.44) v1(69.09,56.44) v1(69.09,55.55) v1(69.09,54.66) v1(69.34,30.66) v1(69.34,29.9) v1(69.6,81.2) v1(69.6,80.44) v1(70.23,30.66) v1(70.23,29.9) v1(70.48,81.2) v1(70.45,68.76) v1(70.45,68) v1(71.34,68.76) v1(71.34,68) v1(71.88,35.1) v1(71.88,34.34) v1(72.14,23.42) v1(72.14,22.66) v1(72.23,68) v1(72.77,35.1) v1(72.77,34.34) v1(73.02,23.42) v1(73.02,22.66) v1(73.66,35.1) v1(73.66,34.34) v1(73.91,23.42) v1(73.91,22.66) v1(77.06,68.76) v1(77.06,68) v1(77.95,68.76) v1(77.95,68) v1(78.83,68.76) v1(78.83,68) v1(80.26,38.91) v1(80.26,38.15) v1(80.61,62.41) v1(80.61,61.52) v1(80.61,60.63) v1(80.77,15.04) v1(80.77,14.28) v1(81.03,30.28) v1(81.03,29.52) v1(81.15,54.92) v1(81.15,54.03) v1(81.15,53.14) v1(81.15,38.91) v1(81.15,38.15) v1(81.37,62.41) v1(81.37,61.52) v1(81.37,60.63) v1(81.66,15.04) v1(81.66,14.28) v1(81.92,54.92) v1(81.92,54.03) v1(81.92,53.14) v1(81.92,30.28) v1(81.92,29.52) v1(82.04,38.91) v1(82.04,38.15) v1(82.55,15.04) v1(82.55,14.28) v1(82.8,30.28) v1(82.8,29.52) v1(84.58,27.99) v1(84.58,27.23) v1(84.71,33.2) v1(84.71,32.44) v1(85.47,27.99) v1(85.47,27.23) v1(85.6,33.2) v1(85.6,32.44) v1(86.36,27.99) v1(86.36,27.23) v1(86.49,33.2) v1(86.49,32.44) v1(88.9,30.02) v1(88.9,29.26) v1(89.41,38.91) v1(89.41,38.15) v1(89.79,30.02) v1(89.79,29.26) v1(90.3,38.91) v1(90.3,38.15) v1(90.42,44.12) v1(90.68,30.02) v1(90.68,29.26) v1(91.19,38.91) v1(91.19,38.15) v1(91.31,44.88) v1(91.31,44.12) v1(92.2,44.88) v1(92.2,44.12) v1(94.87,33.58) v1(94.87,32.82) v1(95.76,33.58) v1(95.76,32.82) v1(96.27,22.15) v1(96.27,21.39) v1(96.65,33.58) v1(96.65,32.82) v1(97.15,25.07) v1(97.15,24.31) v1(97.15,22.15) v1(97.15,21.39) v1(98.04,25.07) v1(98.04,24.31) v1(98.04,22.15) v1(98.04,21.39) v1(98.93,25.07) v1(98.93,24.31)
BLK: length 18.6
  Top Layer w0.203: U1.10 67.54,44.27 68.55,43.26 68.55,38.72 63.14,33.31 1K.1
BOOT: length 23
  Top Layer w0.203: 10K#4.1 82.61,45.83 KEY5.1 81.03,47.42 v1(80.14,48.31) ; U1.26 67.19,52.51 67.56,52.88 v1(68.2,52.88)
  Bottom Layer w0.203: v1(68.2,52.88) 72.77,48.31 v1(80.14,48.31)
CS: length 50.2
  Top Layer w0.178: NOREF#6.1 56.33,47.87 U1.46
  Top Layer w0.203: U14.12 20.37,34.93 21.21,34.09 42.55,34.09 NOREF#6.1
CTP_INT: length 71.9
  Top Layer w0.178: U1.8 66.84,44.21 67.82,43.23 67.82,39.04 65.53,36.75 52.45,36.75 50.09,34.39 50.05,34.39 49.73,34.06 49.73,34.03 46.36,30.66 v1(39.75,30.66)
  Top Layer w0.203: NOREF#3.1 13.21,27.48 12.81,27.88 FPC1.1
  Bottom Layer w0.381: NOREF#3.1 v1(39.75,30.66)
CTP_RST: length 72.7
  Top Layer w0.178: NOREF.1 46.36,31.8 51.94,37.39 65.15,37.39 67.18,39.42 67.18,43.1 66.49,43.8 U1.7
  Top Layer w0.203: NOREF.1 35.94,32.69 11.43,32.69 9.53,30.79 FPC1.4
CTP_SCL: length 76.4
  Top Layer w0.203: FPC1.3 10.03,28.62 10.79,29.39 NOREF#9.1 29.46,29.39 10K#2.2 30.23,29.9 62.48,29.9 70.1,37.52 70.1,47.42 69.65,47.87 U1.13
CTP_SDA: length 78
  Top Layer w0.203: FPC1.2 10.53,28.49 10.79,28.75 13.21,28.75 13.72,28.25 32,28.25 10K#3.2 63.13,29.14 70.61,36.63 70.61,47.68 70.06,48.22 U1.14
DB0: length 113.5
  Top Layer w0.178: U1.24 69.64,51.72 69.77,51.85 69.77,52.61 70.2,53.04
  Top Layer w0.203: U14.17 18.87,41.4 22.15,44.68 22.35,44.68 23.49,43.55 23.69,43.55 24.2,44.07 24.2,44.27 23.07,45.4 23.07,45.6 23.59,46.12 23.79,46.12 24.92,44.99 25.13,44.99 25.64,45.5 25.64,45.71 24.51,46.84 24.51,47.04 25.03,47.56 25.23,47.56 26.36,46.43 26.56,46.43 27.08,46.94 27.08,47.14 25.95,48.27 25.95,48.48 26.46,48.99 26.67,48.99 27.8,47.86 28,47.86 28.51,48.38 28.51,48.58 27.38,49.71 27.38,49.91 27.9,50.43 28.1,50.43 29.23,49.3 29.44,49.3 29.95,49.81 29.95,50.02 28.82,51.15 28.82,51.35 29.34,51.87 29.54,51.87 30.67,50.74 30.87,50.74 31.39,51.25 31.39,51.45 30.26,52.58 30.26,52.79 30.77,53.3 30.98,53.3 32.11,52.17 32.31,52.17 32.83,52.69 32.83,52.89 31.69,54.02 31.69,54.22 32.21,54.74 32.41,54.74 33.54,53.61 33.75,53.61 34.26,54.12 34.26,54.33 33.13,55.46 33.13,55.66 33.65,56.18 33.85,56.18 34.98,55.05 35.18,55.05 35.7,55.56 35.7,55.77 34.57,56.9 34.57,57.1 35.08,57.61 35.29,57.61 36.42,56.48 36.62,56.48 37.14,57 37.14,57.2 36,58.33 36,58.54 37.46,60 38.84,60 38.98,59.85 38.98,58.49 39.12,58.34 39.85,58.34 40,58.49 40,59.85 40.14,60 40.87,60 41.01,59.85 41.01,58.49 41.16,58.34 41.89,58.34 42.03,58.49 42.03,59.85 42.17,60 42.9,60 43.05,59.85 43.05,58.49 43.19,58.34 43.92,58.34 44.06,58.49 44.06,59.85 44.2,60 69.09,60 69.82,59.26 NOREF#5.1
DB1: length 110.1
  Top Layer w0.178: U1.23 70.56,51.37 71.09,51.9 71.09,52.79 71.34,53.04
  Top Layer w0.203: v1(18.03,42.22) 18.03,43.61 18.49,44.07 18.7,44.07 19.51,43.26 19.71,43.26 20.23,43.78 20.23,43.98 19.42,44.79 19.42,45 19.93,45.51 20.14,45.51 20.95,44.7 21.15,44.7 21.67,45.21 21.67,45.42 20.85,46.23 20.85,46.43 21.37,46.95 21.57,46.95 22.38,46.13 22.59,46.13 23.1,46.65 23.1,46.85 22.29,47.67 22.29,47.87 22.81,48.38 23.01,48.38 23.82,47.57 24.02,47.57 24.54,48.09 24.54,48.29 23.73,49.1 23.73,49.31 24.24,49.82 24.45,49.82 25.26,49.01 25.46,49.01 25.98,49.52 25.98,49.73 25.16,50.54 25.16,50.74 25.68,51.26 25.88,51.26 26.7,50.44 26.9,50.44 27.41,50.96 27.41,51.16 26.6,51.98 26.6,52.18 27.12,52.69 27.32,52.69 28.13,51.88 28.34,51.88 28.85,52.4 28.85,52.6 28.04,53.41 28.04,53.62 28.55,54.13 28.76,54.13 29.57,53.32 29.77,53.32 30.29,53.83 30.29,54.04 29.47,54.85 29.47,55.05 29.99,55.57 30.19,55.57 31.01,54.76 31.21,54.76 31.72,55.27 31.72,55.47 30.91,56.29 30.91,56.49 31.43,57.01 31.63,57.01 32.44,56.19 32.65,56.19 33.16,56.71 33.16,56.91 32.35,57.72 32.35,57.93 32.86,58.44 33.07,58.44 33.88,57.63 34.08,57.63 34.6,58.14 34.6,58.35 33.79,59.16 33.79,59.36 34.2,59.78 34.4,59.78 35.22,58.97 35.42,58.97 35.94,59.48 35.94,59.69 35.12,60.5 35.12,60.7 35.18,60.76 70.61,60.76 71.09,60.28 NOREF#12.1
  Top Layer w0.254: U14.18 18.57,37.16 v1(18.67,37.26)
  Bottom Layer w0.254: v1(18.67,37.26) 18.67,38.41 18.03,39.04 v1(18.03,42.22)
DB2: length 108.2
  Top Layer w0.178: 72.61,53.04 72.36,52.79 72.36,51.77 71.61,51.02 U1.22
  Top Layer w0.203: U14.19 18.27,40.33 17.14,41.45 17.14,45.64 17.47,45.97 17.68,45.97 18.36,45.29 18.57,45.29 19.08,45.8 19.08,46.01 17.7,47.39 17.7,47.59 18.21,48.11 18.42,48.11 19.8,46.72 20,46.72 20.52,47.24 20.52,47.44 19.83,48.13 19.83,48.33 20.35,48.85 20.55,48.85 21.24,48.16 21.44,48.16 21.96,48.68 21.96,48.88 21.27,49.57 21.27,49.77 21.78,50.28 21.99,50.28 22.67,49.6 22.88,49.6 23.39,50.11 23.39,50.32 22.71,51 22.71,51.21 23.22,51.72 23.42,51.72 24.11,51.04 24.31,51.04 24.83,51.55 24.83,51.75 24.14,52.44 24.14,52.64 24.66,53.16 24.86,53.16 25.55,52.47 25.75,52.47 26.27,52.99 26.27,53.19 25.58,53.88 25.58,54.08 26.1,54.59 26.3,54.59 26.98,53.91 27.19,53.91 27.7,54.42 27.7,54.63 27.02,55.31 27.02,55.52 27.53,56.03 27.74,56.03 28.42,55.35 28.62,55.35 29.14,55.86 29.14,56.06 28.45,56.75 28.45,56.95 28.97,57.47 29.17,57.47 29.86,56.78 30.06,56.78 30.58,57.3 30.58,57.5 29.89,58.19 29.89,58.39 30.41,58.91 30.61,58.91 31.3,58.22 31.5,58.22 32.01,58.73 32.01,58.94 31.33,59.62 31.33,59.83 31.84,60.34 32.05,60.34 32.73,59.66 32.93,59.66 33.45,60.17 33.45,60.37 32.76,61.06 32.76,61.26 33.15,61.65 70.87,61.65 72.36,60.15 NOREF#2.1
DB3: length 109.9
  Top Layer w0.178: 73.88,53.04 73.63,52.79 73.63,51.77 72.53,50.67 U1.21
  Top Layer w0.203: v1(17.27,48.69) 17.78,49.2 17.98,49.2 18.66,48.51 18.87,48.51 19.38,49.03 19.38,49.23 18.7,49.91 18.7,50.12 19.21,50.63 19.42,50.63 20.1,49.95 20.3,49.95 20.82,50.46 20.82,50.67 20.13,51.35 20.13,51.55 20.65,52.07 20.85,52.07 21.54,51.38 21.74,51.38 22.26,51.9 22.26,52.1 21.57,52.79 21.57,52.99 22.09,53.51 22.29,53.51 22.97,52.82 23.18,52.82 23.69,53.34 23.69,53.54 23.01,54.22 23.01,54.43 23.52,54.94 23.73,54.94 24.41,54.26 24.61,54.26 25.13,54.77 25.13,54.98 24.44,55.66 24.44,55.86 24.96,56.38 25.16,56.38 25.85,55.69 26.05,55.69 26.57,56.21 26.57,56.41 25.88,57.1 25.88,57.3 26.4,57.82 26.6,57.82 27.29,57.13 27.49,57.13 28,57.65 28,57.85 27.32,58.54 27.32,58.74 27.83,59.25 28.04,59.25 28.72,58.57 28.93,58.57 29.44,59.08 29.44,59.29 28.75,59.97 28.75,60.18 29.27,60.69 29.47,60.69 30.16,60 30.36,60 30.88,60.52 30.88,60.72 30.19,61.41 30.19,61.61 31.11,62.54 71.37,62.54 73.63,60.28 NOREF#10.1
  Top Layer w0.254: U14.20 17.97,37.84 v1(17.91,37.9)
  Bottom Layer w0.254: v1(17.91,37.9) 17.27,38.53 v1(17.27,48.69)
DB4: length 110
  Top Layer w0.178: NOREF#13.1 74.9,51.77 73.45,50.32 U1.20
  Top Layer w0.203: U14.21 17.67,39.92 16.51,41.07 16.51,50.72 16.77,50.98 16.97,50.98 17.66,50.3 17.86,50.3 18.38,50.81 18.38,51.01 17.69,51.7 17.69,51.9 18.2,52.42 18.41,52.42 19.09,51.73 19.3,51.73 19.81,52.25 19.81,52.45 19.13,53.14 19.13,53.34 19.64,53.86 19.84,53.86 20.53,53.17 20.73,53.17 21.25,53.68 21.25,53.89 20.56,54.57 20.56,54.78 21.08,55.29 21.28,55.29 21.97,54.61 22.17,54.61 22.69,55.12 22.69,55.32 22,56.01 22,56.21 22.52,56.73 22.72,56.73 23.4,56.04 23.61,56.04 24.12,56.56 24.12,56.76 23.44,57.45 23.44,57.65 23.95,58.17 24.15,58.17 24.84,57.48 25.04,57.48 25.56,58 25.56,58.2 24.87,58.88 24.87,59.09 25.39,59.6 25.59,59.6 26.28,58.92 26.48,58.92 27,59.43 27,59.64 26.31,60.32 26.31,60.52 26.83,61.04 27.03,61.04 27.71,60.35 27.92,60.35 28.43,60.87 28.43,61.07 27.75,61.76 27.75,61.96 29.21,63.42 71.63,63.42 74.9,60.15 NOREF#13.1
DB5: length 112.4
  Top Layer w0.178: NOREF#4.1 76.11,51.14 74.94,49.97 68.41,49.97
  Top Layer w0.203: NOREF#4.1 76.17,60.15 72.01,64.31 27.43,64.31 26.93,63.81 26.93,63.61 27.43,63.11 27.43,62.91 26.91,62.4 26.71,62.4 26.21,62.89 26.01,62.89 25.49,62.38 25.49,62.17 25.99,61.68 25.99,61.47 25.47,60.96 25.27,60.96 24.78,61.45 24.57,61.45 24.06,60.94 24.06,60.73 24.55,60.24 24.55,60.04 24.04,59.52 23.83,59.52 23.34,60.02 23.14,60.02 22.62,59.5 22.62,59.3 23.12,58.8 23.12,58.6 22.6,58.08 22.4,58.08 21.9,58.58 21.7,58.58 21.18,58.06 21.18,57.86 21.68,57.37 21.68,57.16 21.16,56.65 20.96,56.65 20.46,57.14 20.26,57.14 19.75,56.63 19.75,56.42 20.24,55.93 20.24,55.73 19.73,55.21 19.52,55.21 19.03,55.71 18.82,55.71 18.31,55.19 18.31,54.99 18.8,54.49 18.8,54.29 18.29,53.77 18.09,53.77 17.59,54.27 17.39,54.27 16.51,53.39 v1(16.51,53.26)
  Top Layer w0.254: v1(17.14,37.26) 17.37,37.04 U14.22
  Bottom Layer w0.254: v1(16.51,53.26) 16.51,37.9 v1(17.14,37.26)
DB6: length 113.5
  Top Layer w0.178: NOREF#7.1 76.94,49.62 U1.18
  Top Layer w0.203: U14.23 17.07,39.75 15.75,41.07 15.75,55.42 16.38,56.05 16.58,56.05 17.14,55.49 17.34,55.49 17.86,56.01 17.86,56.21 17.3,56.77 17.3,56.97 17.81,57.49 18.02,57.49 18.57,56.93 18.78,56.93 19.29,57.44 19.29,57.65 18.73,58.21 18.73,58.41 19.25,58.93 19.45,58.93 20.01,58.37 20.21,58.37 20.73,58.88 20.73,59.08 20.17,59.64 20.17,59.85 20.69,60.36 20.89,60.36 21.45,59.8 21.65,59.8 22.17,60.32 22.17,60.52 21.61,61.08 21.61,61.28 22.12,61.8 22.33,61.8 22.89,61.24 23.09,61.24 23.6,61.76 23.6,61.96 23.04,62.52 23.04,62.72 25.53,65.2 73.02,65.2 77.44,60.79 NOREF#7.1
DB7: length 113.6
  Top Layer w0.178: U14.24 16.04,35.95 14.6,37.39 14.6,55.68 25.02,66.09 73.91,66.09 78.61,61.39 78.61,49.27 U1.17
DC: length 51.1
  Top Layer w0.178: U1.48 60.46,47.17 NOREF#11.1
  Top Layer w0.203: U14.14 19.77,34.64 20.83,33.58 46.86,33.58 NOREF#11.1
KEY1: length 39.2
  Top Layer w0.178: v1(61.11,49.48) 61.32,49.27 U1.42 ; v1(75.18,78.66) 75.18,80.25 KEY1.1
  Bottom Layer w0.178: v1(61.11,49.48) 61.11,61.41 75.18,75.49 v1(75.18,78.66)
KEY2: length 28.9
  Top Layer w0.178: v1(60.2,49.75) 60.48,50.03 61.78,50.03 62.19,49.62 U1.41 ; KEY2.1 65.91,72.44 v1(64.52,71.04)
  Bottom Layer w0.178: v1(64.52,71.04) 60.2,66.73 v1(60.2,49.75)
KEY3: length 46.4
  Top Layer w0.178: v1(65.91,87.05) 65.91,88.89 KEY3.1 ; 63.51,49.97 62.47,49.97 62.1,50.34 59.69,50.34 v1(59.31,49.96)
  Bottom Layer w0.178: v1(59.31,49.96) 59.31,66.98 65.91,73.58 v1(65.91,87.05)
KEY4: length 37.8
  Top Layer w0.178: KEY4.1 63.94,78.47 v1(63.88,78.41) ; U1.39 63.5,50.34 62.74,50.34 62.41,50.67 58.88,50.67 v1(58.42,50.21)
  Bottom Layer w0.178: v1(58.42,50.21) 58.42,66.98 63.88,72.44 v1(63.88,78.41)
LEDK: length 34.2
  Top Layer w0.381: U14.6 22.17,35.36 22.55,34.98 v1(41.27,34.98)
  Top Layer w0.508: v1(52.32,33.83) 52.33,33.82 S8050.2
  Bottom Layer w0.508: v1(41.27,34.98) 51.17,34.98 v1(52.32,33.83)
RD: length 50.3
  Top Layer w0.178: U1.43 50.14,48.92 NOREF#14.1
  Top Layer w0.203: U14.16 19.17,36.74 19.81,37.39 38.73,37.39 44.7,43.36 NOREF#14.1
RES: length 47.6
  Top Layer w0.178: U1.47 58.39,47.52 NOREF#17.1
  Top Layer w0.203: v1(20.19,40.31) 20.07,40.18 U14.13
  Bottom Layer w0.254: v1(20.19,40.31) 51.18,40.31 NOREF#17.1
SCL: length 48
  Top Layer w0.178: U1.45 54.27,48.22 NOREF#15.1
  Top Layer w0.203: NOREF#15.1 42.93,36.88 21.21,36.88 20.97,36.64 U14.10
TCK: length 6.4
  Top Layer w0.203: U1.11 68.41,46.95 v1(69.34,46.03)
  Bottom Layer w0.203: v1(69.34,46.03) 70.48,46.03 仿真.3
TIO: length 5.4
  Top Layer w0.203: U1.12 68.86,47.52 68.88,47.5 68.89,47.5 69.04,47.35 69.04,47.34 v1(69.34,47.04)
  Bottom Layer w0.203: 仿真.4 72.01,47.04 v1(69.34,47.04)
UART_RX3: length 10.2
  Top Layer w0.178: U1.36 55.48,51.37 RX.1
UART_TX3: length 12
  Top Layer w0.178: U1.37 53.8,51.02 52.7,52.12 RX.2
USB_N: length 46.1
  Top Layer w0.178: USB1.5 93.92,22.67 95.89,24.63 95.89,28.75 75.71,48.92 U1.16
  Top Layer w0.203: USB1.5 93.12,22.66 92.46,22.66 92.2,22.91 92.2,23.42 92.45,23.67 USB1.7
USB_P: length 43.1
  Top Layer w0.178: U1.15 75.3,48.57 95.38,28.5 95.38,25.05 93.98,23.66
  Top Layer w0.203: USB1.8 93.74,24.17 93.98,23.93 93.98,23.42 93.73,23.16 93.13,23.16 USB1.6
VDCIA: length 20.1
  Top Layer w0.203: U1.35 62,51.72 61.82,51.9 v1(61.82,51.96) ; 22uH.2 62.3,43.36 62.3,44.25 64.39,46.34 U1.1
  Top Layer w0.254: v1(61.82,45.68) 62.3,45.2 62.3,44.25
  Top Layer w0.508: 2.2uF#2.2 100nF#5.2 60.96,52.82 v1(61.82,51.96)
  Bottom Layer w0.254: v1(61.82,45.68) v1(61.82,51.96)
VSW: length 6
  Top Layer w0.203: U1.2 64.74,45.1 62.3,42.66 62.3,41.96
WR: length 49
  Top Layer w0.178: U1.44 52.2,48.57 NOREF#8.1
  Top Layer w0.203: U14.15 19.47,40.85 v1(19.56,40.95)
  Bottom Layer w0.254: v1(19.56,40.95) 44.58,40.95 NOREF#8.1
X32MI: length 3.2
  Top Layer w0.152: U1.32 65.09,53.71 65.69,54.31 32Mhz.3
X32MO: length 4.8
  Top Layer w0.152: 32Mhz.1 67.02,56.01 66.37,55.36 66.37,54.41 65.44,53.48 U1.31
$1N1243: length 3.6
  Top Layer w0.203: U1.33 64.74,53.76 2.2uF.2
$1N4528: length 4.6
  Top Layer w0.508: 10K.1 1K.2 58.84,33.82 S8050.1
$1N4553: length 3.5
  Top Layer w0.508: 10R.1 56.84,31.12 S8050.3

## Copper pours and planes (outline as drawn; the poured copper is in the pictures)
GND on Top Layer: -5.72,107.37 106.17,107.37 106.17,-2.49 -5.72,-2.49
GND on Bottom Layer: -6.41,109.72 105.47,109.72 105.47,-0.14 -6.41,-0.14
(no net) on Bottom Layer: 64.9,56.81 67.83,56.81 67.83,54.18 64.9,54.18

Small or netless copper shapes (teardrops, artwork), in the pictures only: 52 on Bottom Layer, 184 on Top Layer

## Text on the board
Top Silkscreen Layer: CTP_SCL | CTP_SDA | CTP_INT | CTP_RST | RD | GND | WR | SCL | CS | TX | RES | RX | DC | 3V3 | TIO_PB14 | TCK_PB15 | 0R焊接为拉高 / 不焊为使用SCL | 测试点 | 测功耗 | BOOT按键 | CST816S 电容触摸 / GA9A01 TFT LCD屏幕 / 圆形触摸屏测试专用板
